# EAGLE design netzteil (EAGLE 6.5.0)
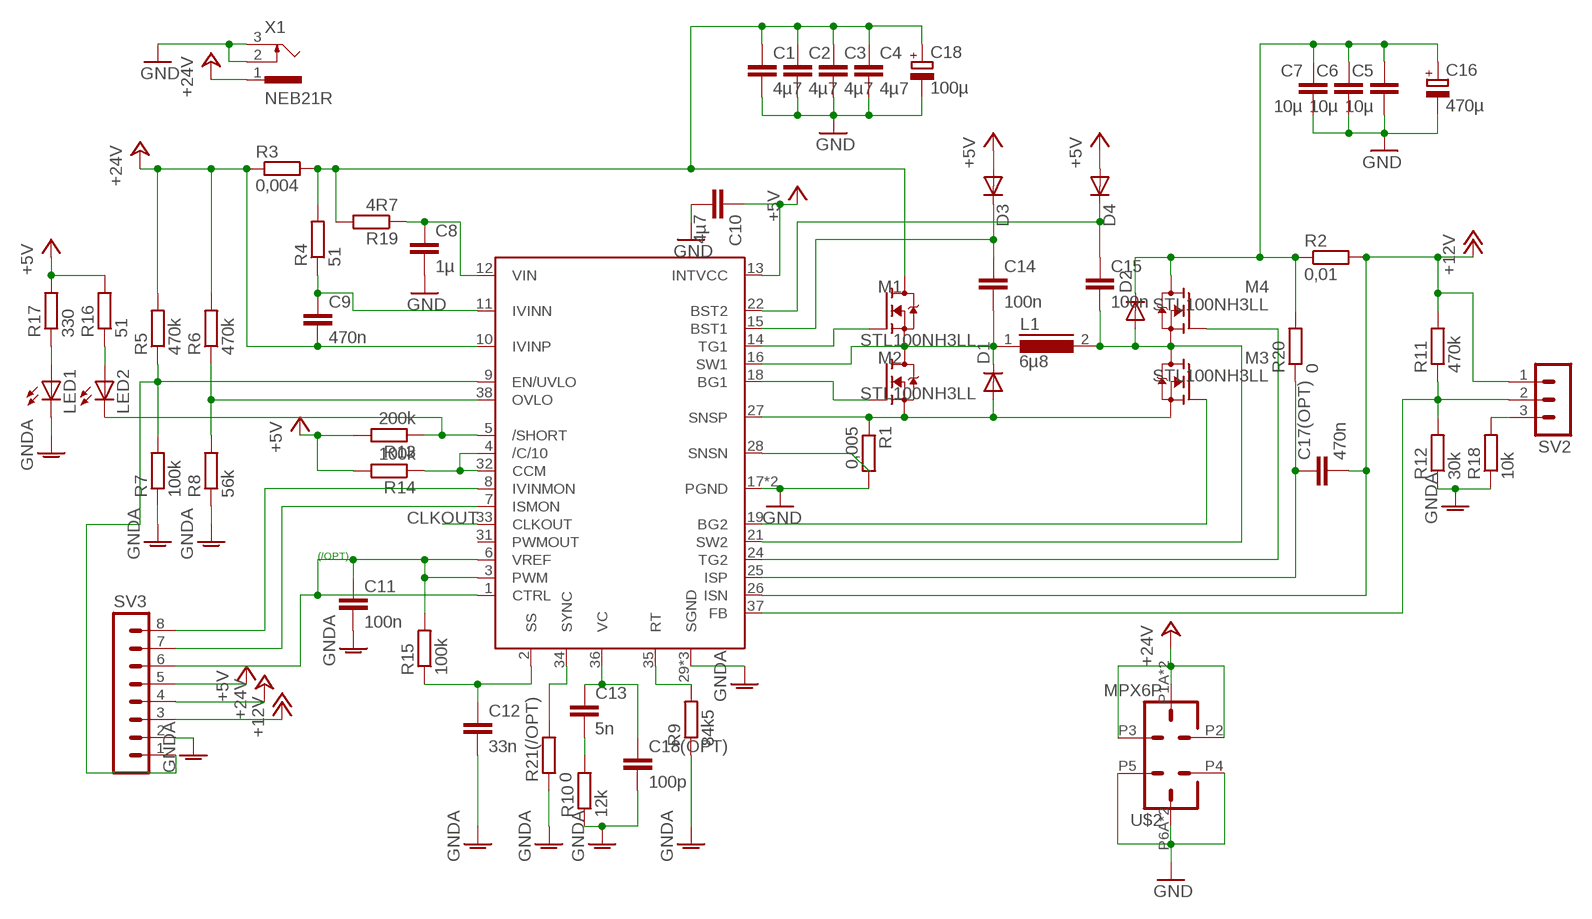
[diagram p0: schematic, sheet 1]

## Parts
C1  4µ7  C-EUC1206K  [C1206K]
C2  4µ7  C-EUC1206K  [C1206K]
C3  4µ7  C-EUC1206K  [C1206K]
C4  4µ7  C-EUC1206K  [C1206K]
C5  10µ  C-EUC1206K  [C1206K]
C6  10µ  C-EUC1206K  [C1206K]
C7  10µ  C-EUC1206K  [C1206K]
C8  1µ  C-EUC0805K  [C0805K]
C9  470n  C-EUC0805K  [C0805K]
C10  4µ7  C-EUC0805K  [C0805K]
C11  100n  C-EUC0805K  [C0805K]
C12  33n  C-EUC0805K  [C0805K]
C13  5n  C-EUC0805K  [C0805K]
C14  100n  C-EUC0805K  [C0805K]
C15  100n  C-EUC0805K  [C0805K]
C16  470µ  CPOL-EU153CLV-1010  [153CLV-1010]
C17(OPT)  470n  C-EUC0805K  [C0805K]
C18  100µ  CPOL-EU153CLV-0605  [153CLV-0605]
C18(OPT)  100p  C-EUC0805K  [C0805K]
D1  DIODE-SOD323-R  [SOD323-R]
D2  DIODE-SOD323-R  [SOD323-R]
D3  DIODE-SOD323-R  [SOD323-R]
D4  DIODE-SOD323-R  [SOD323-R]
L1  6µ8  DR125  [DR125]
LED1  LEDSML0805  [SML0805]
LED2  LEDSML0805  [SML0805]
M1  STL100NH3LL  [PG-TDSON-8]
M2  STL100NH3LL  [PG-TDSON-8]
M3  STL100NH3LL  [PG-TDSON-8]
M4  STL100NH3LL  [PG-TDSON-8]
R1  0,005  R-EU_R2512  [R2512]
R2  0,01  R-EU_R2512  [R2512]
R3  0,004  R-EU_R2512  [R2512]
R4  51  R-EU_M0805  [M0805]
R5  470k  R-EU_M0805  [M0805]
R6  470k  R-EU_M0805  [M0805]
R7  100k  R-EU_M0805  [M0805]
R8  56k  R-EU_M0805  [M0805]
R9  84k5  R-EU_M0805  [M0805]
R10  12k  R-EU_M0805  [M0805]
R11  470k  R-EU_M0805  [M0805]
R12  30k  R-EU_M0805  [M0805]
R13  200k  R-EU_M0805  [M0805]
R14  100k  R-EU_M0805  [M0805]
R15  100k  R-EU_M0805  [M0805]
R16  51  R-EU_M0805  [M0805]
R17  330  R-EU_M0805  [M0805]
R18  10k  R-EU_M0805  [M0805]
R19  4R7  R-EU_M0805  [M0805]
R20  0  R-EU_M0805  [M0805]
R21(/OPT)  0  R-EU_M0805  [M0805]
SV2  MA03-1  [MA03-1]
SV3  MA08-1  [MA08-1]
U$1  LT3790  [HTSSOP38DCP]
U$2  MPX6P  [MPX6]
X1  NEB21R  [NEB21R]

## Nets
+5V: C10.1 D3.A D4.A R13.2 R14.2 R16.2 R17.2 SV3.5 U$1.13(INTVCC)
+12V: C17(OPT).2 R2.2 R11.2 SV2.1 SV3.3 U$1.26(ISN)
+24V: C9.2 R3.1 R5.2 R6.2 SV3.4 U$1.10(IVINP) U$2.P1A U$2.P1B U$2.P2 U$2.P3 X1.1
BG1: M2.4(G) U$1.18(BG1)
BG2: M3.4(G) U$1.19(BG2)
BST1: C14.1 D3.C U$1.15(BST1)
BST2: C15.1 D4.C U$1.22(BST2)
CLKOUT: U$1.33(CLKOUT)
GND: C1.2 C2.2 C3.2 C4.2 C5.2 C6.2 C7.2 C8.2 C10.2 C16.- C18.- R1.2 U$1.17(PGND) U$1.20(PGND) U$2.P4 U$2.P5 U$2.P6A U$2.P6B X1.2 X1.3
GNDA: C11.2 C12.2 C18(OPT).2 LED1.C R7.1 R8.1 R9.1 R10.1 R12.1 R18.1 R21(/OPT).1 SV3.2 U$1.29(SGND) U$1.30(SGND) U$1.EXP@1(SGND)
ISP: C5.1 C6.1 C7.1 C16.+ D2.C M4.5(D) M4.6(D) M4.7(D) M4.8(D) M4.TH(D) R2.1 R20.2
N$1: U$1.28(SNSN)
N$2: SV3.7 U$1.7(ISMON)
N$3: SV3.8 U$1.8(IVINMON)
N$4: LED1.A R17.1
N$5: LED2.A R16.1
N$6: R18.2 SV2.3
N$7: C13.2 R10.2
N$8: C13.1 C18(OPT).1 U$1.36(VC)
N$9: C8.1 R19.1 U$1.12(VIN)
N$10: C17(OPT).1 R20.1 U$1.25(ISP)
N$12: C9.1 R4.1 U$1.11(IVINN)
N$13: R5.1 R7.2 SV3.1 U$1.9(EN/UVLO)
N$14: R6.1 R8.2 U$1.38(OVLO)
N$17: R11.1 R12.2 SV2.2 U$1.37(FB)
N$18: R14.1 U$1.4(/C/10) U$1.32(CCM)
N$20: LED2.C R13.1 U$1.5(/SHORT)
N$22: C12.1 R15.1 U$1.2(SS)
N$24: R9.2 U$1.35(RT)
N$25: C11.1 R15.2 SV3.6 U$1.1(CTRL) U$1.3(PWM) U$1.6(VREF)
SNSP: D1.A M2.1(S) M2.2(S) M2.3(S) M3.1(S) M3.2(S) M3.3(S) R1.1 U$1.27(SNSP)
SW1: C14.2 D1.C L1.1 M1.1(S) M1.2(S) M1.3(S) M2.5(D) M2.6(D) M2.7(D) M2.8(D) M2.TH(D) U$1.16(SW1)
SW2: C15.2 D2.A L1.2 M3.5(D) M3.6(D) M3.7(D) M3.8(D) M3.TH(D) M4.1(S) M4.2(S) M4.3(S) U$1.21(SW2)
SYNC: R21(/OPT).2 U$1.34(SYNC)
TG1: M1.4(G) U$1.14(TG1)
TG2: M4.4(G) U$1.24(TG2)
VINN: C1.1 C2.1 C3.1 C4.1 C18.+ M1.5(D) M1.6(D) M1.7(D) M1.8(D) M1.TH(D) R3.2 R4.2 R19.2
Unconnected: U$1.31(PWMOUT)

## Notes on the sheet
- (/OPT)

## Library data of the parts
C1-C15 C17(OPT) C18(OPT) = resistor:C-EU: CAPACITOR, European symbol
C16 C18 = resistor:CPOL-EU: POLARIZED CAPACITOR, European symbol
D1-D4 = diode:DIODE-: DIODE
L1 = inductors:DR125: High Power Density, High Efficiency, Shielded Inductors Source: coiltronics_dr_series.pdf
LED1 LED2 = led:LED: LED OSRAM: - CHIPLED LG R971, LG N971, LY N971, LG Q971, LY Q971, LO R971, LY R971 LH N974, LH R974 LS Q976, LO Q976, LY Q976 LO Q996 - Hyper CHIPLED LW Q18S LB Q993, LB Q99A, LB R99A - SideLED LS A670, LO A670, LY A670, LG A670, LP A670 LB A673, LV A673, LT A673, LW A673 LH A674 LY A675 LS A676, LA A676, LO A676, LY A676, LW A676 LS A679, LY A679, LG A679 - Hyper Micro SIDELED® LS Y876, LA Y876, LO Y876, LY Y876 LT Y87S - SmartLED LW L88C, LW L88S LB L89C, LB L89S, LG L890 LS L89K, LO L89K, LY L89K LS L896, LA L896, LO L896, LY L896 - TOPLED LS T670, LO T670, LY T670, LG T670, LP T670 LSG T670, LSP T670, LSY T670, LOP T670, LYG T670 LG T671, LOG T671, LSG T671 LB T673, LV T673, LT T673, LW T673 LH T674 LS T676, LA T676, LO T676, LY T676, LB T676, LH T676, LSB T676, LW T676 LB T67C, LV T67C, LT T67C, LS T67K, LO T67K, LY T67K, LW E67C LS E67B, LA E67B, LO E67B, LY E67B, LB E67C, LV E67C, LT E67C LW T67C LS T679, LY T679, LG T679 LS T770, LO T770, LY T770, LG T770, LP T770 LB T773, LV T773, LT T773, LW T773 LH T774 LS E675, LA E675, LY E675, LS T675 LS T776, LA T776, LO T776, LY T776, LB T776 LHGB T686 LT T68C, LB T68C - Hyper Mini TOPLED® LB M676 - Mini TOPLED Santana® LG M470 LS M47K, LO M47K, LY M47K Source: http://www.osram.convergy.de LUXEON: - LUMILED® LXK2-PW12-R00, LXK2-PW12-S00, LXK2-PW14-U00, LXK2-PW14-V00 LXK2-PM12-R00, LXK2-PM12-S00, LXK2-PM14-U00 LXK2-PE12-Q00, LXK2-PE12-R00, LXK2-PE12-S00, LXK2-PE14-T00, LXK2-PE14-U00 LXK2-PB12-K00, LXK2-PB12-L00, LXK2-PB12-M00, LXK2-PB14-N00, LXK2-PB14-P00, LXK2-PB14-Q00 LXK2-PR12-L00, LXK2-PR12-M00, LXK2-PR14-Q00, LXK2-PR14-R00 LXK2-PD12-Q00, LXK2-PD12-R00, LXK2-PD12-S00 LXK2-PH12-R00, LXK2-PH12-S00 LXK2-PL12-P00, LXK2-PL12-Q00, LXK2-PL12-R00 Source: www.luxeon.com KINGBRIGHT: KA-3528ASYC Source: www.kingbright.com
M1-M4 = teile:STL100NH3LL: STL100NH3LL n-fet 30V 12,5A(100A) 3,2mohm
R1-R20 R21(/OPT) = resistor:R-EU_: RESISTOR, European symbol
SV2 = con-lstb:MA03-1: PIN HEADER; OC_FARNELL: unknown; OC_NEWARK: unknown
SV3 = con-lstb:MA08-1: PIN HEADER; OC_FARNELL: unknown; OC_NEWARK: unknown
U$1 = teile:LT3790: Schaltregler synchron 4switch buck-boost 60V
U$2 = con-ml:MPX6P
X1 = con-lumberg:NEB21R: Netzgeräte-Einbaukupplung abgewinkelte Ausführung mit Öffner Source: http://www.lumberg.com/Produkte/PDFs/NEB21R.pdf; MPN: NEB 21 R; OC_FARNELL: 1217037; OC_NEWARK: 97K6458

## Board
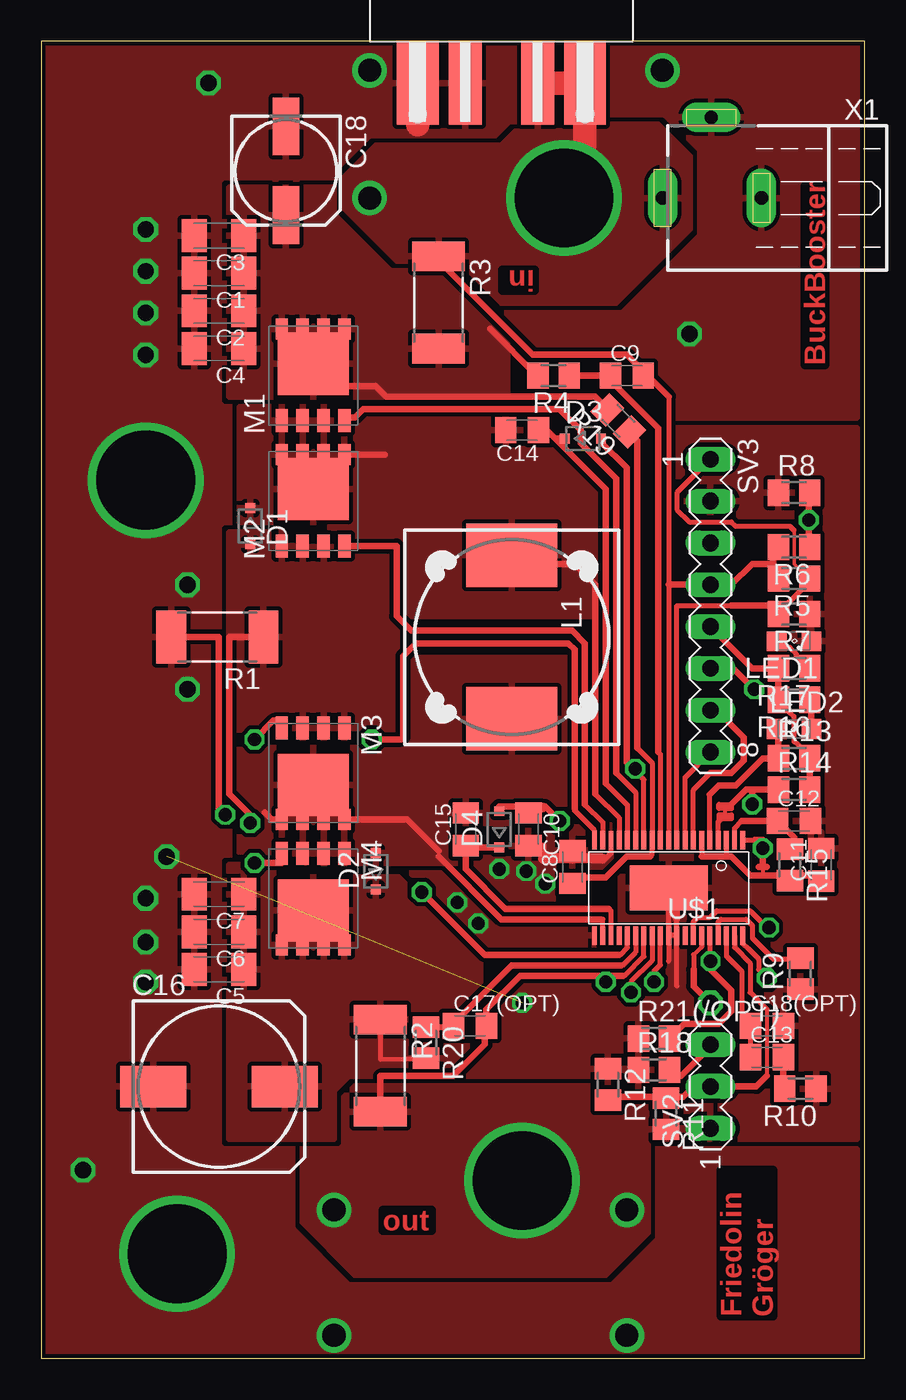
[diagram p1: board, top side]
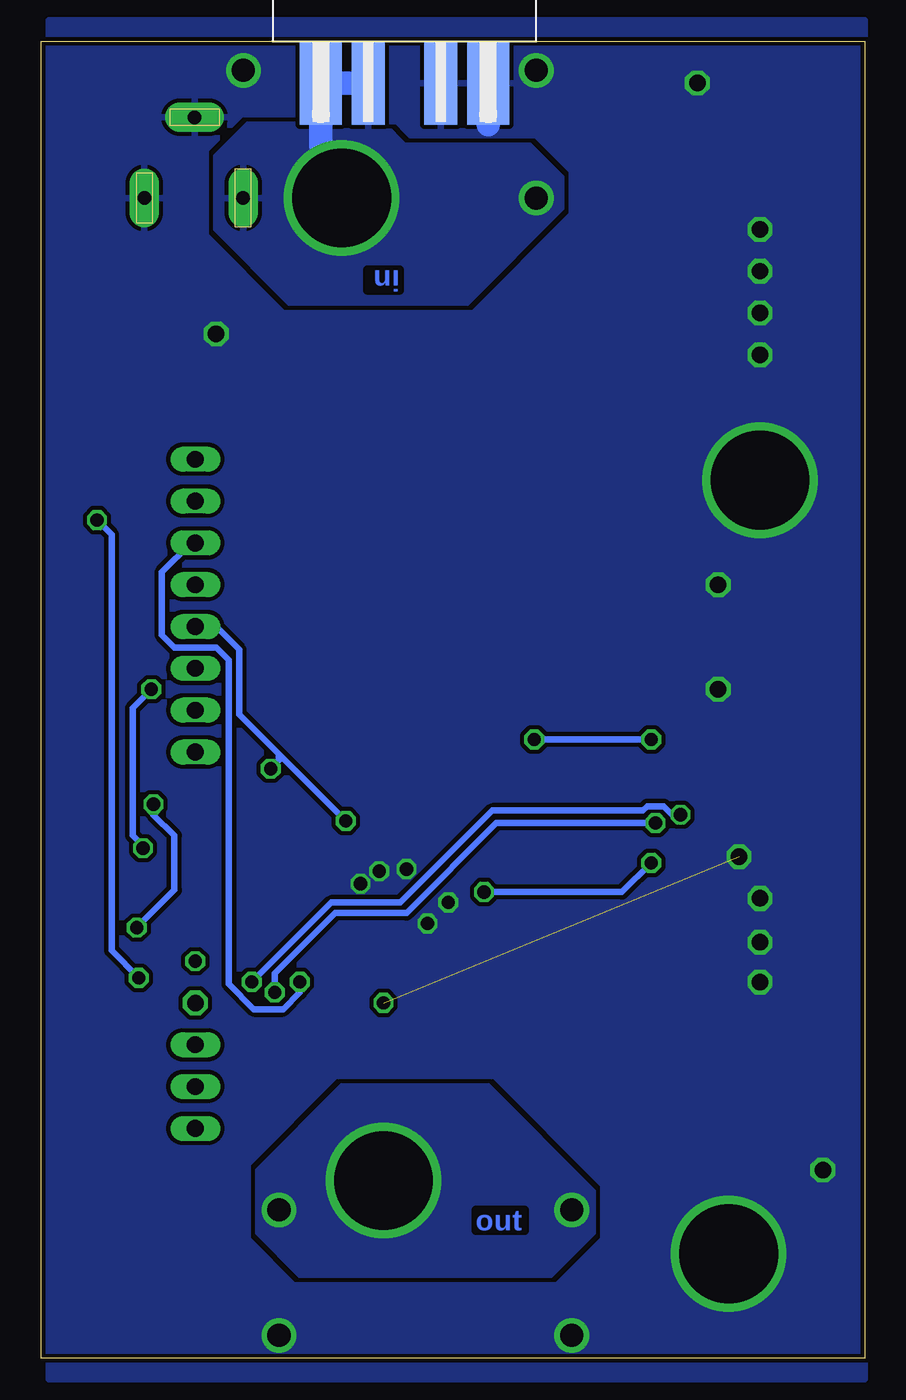
[diagram p2: board, bottom side, seen from below]

Size 50 x 80 mm. Coordinates in mm from the lower left corner, seen from the top.
Outline: 0,0 50,0 50,80 0,80 0,0
Copper layers (1*16): Top 0.035mm / dielectric 1.5mm / Bottom 0.035mm
Design rules "platinenbelichter2 *": minimum track width 0.18mm, minimum drill 23mil, track to track 0.2mm, track to pad 0.2mm, pad to pad 0.2mm, via to via 0.2mm, smd to smd 0.2mm, copper to edge 10mil, drill to drill 8mil, minimum pad ring 10mil, minimum via ring 8mil, stop-mask expansion 10mil, vias tented up to drill 0mil, thermal gap 10mil

### Footprints (pad centres in the part's own frame; a part is rotated, then mirrored left to right if it is on the bottom)
C1206K = smd 1.5 x 2: 1 -1.5,0; 2 1.5,0
C0805K = smd 1.3 x 1.6: 1 -1,0; 2 1,0
153CLV-1010 = smd 4 x 2.5: + 4,0; - -4,0
153CLV-0605 = smd 3.5 x 1.6: + 2.7,0; - -2.7,0
SOD323-R = smd 0.6 x 0.6: A 1.1,0; C -1.1,0
DR125 = smd 3.85 x 5.5: 1 -4.975,0; 2 4.975,0
SML0805 = smd 1.2 x 1.2: A 1.05,0; C -1.05,0
PG-TDSON-8 = smd 1.4 x 0.75: 1 -2.725,1.905; 2 -2.725,0.635; 3 -2.725,-0.635; 4 -2.725,-1.905 | smd 1.3 x 0.75: 5 2.825,-1.905; 6 2.825,-0.635; 7 2.825,0.635; 8 2.825,1.905 | smd 3.78 x 4.305: TH 0.725,0
R2512 = smd 1.8 x 3.2: 1 -2.8,0; 2 2.8,0
M0805 = smd 1.3 x 1.6: 1 -0.95,0; 2 0.95,0
MA03-1 = drill 1.016 long: 1 -2.54,0; 2 0,0; 3 2.54,0
MA08-1 = drill 1.016 long: 1 -8.89,0; 2 -6.35,0; 3 -3.81,0; 4 -1.27,0; 5 1.27,0; 6 3.81,0; 7 6.35,0; 8 8.89,0
HTSSOP38DCP = smd 0.3 x 1.1: 1 -4.5,-2.9; 2 -4,-2.9; 3 -3.5,-2.9; 4 -3,-2.9; 5 -2.5,-2.9; 6 -2,-2.9; 7 -1.5,-2.9; 8 -1,-2.9; 9 -0.5,-2.9; 10 0,-2.9; 11 0.5,-2.9; 12 1,-2.9; 13 1.5,-2.9; 14 2,-2.9; 15 2.5,-2.9; 16 3,-2.9; 17 3.5,-2.9; 18 4,-2.9; 19 4.5,-2.9; 20 4.5,2.9; 21 4,2.9; 22 3.5,2.9; 23 3,2.9; 24 2.5,2.9; 25 2,2.9; 26 1.5,2.9; 27 1,2.9; 28 0.5,2.9; 29 0,2.9; 30 -0.5,2.9; 31 -1,2.9; 32 -1.5,2.9; 33 -2,2.9; 34 -2.5,2.9; 35 -3,2.9; 36 -3.5,2.9; 37 -4,2.9; 38 -4.5,2.9 | smd 4.75 x 2.743: EXP@1 0,0
MPX6 = smd 2.54 x 5.08 bottom: P1A 5.08,-2.54; P6A -5.08,-2.54 | smd 2.54 x 5.08: P1B 5.08,-2.54; P6B -5.08,-2.54 | smd 2 x 5.08: P2 2.2,-2.54; P4 -2.2,-2.54 | smd 2 x 5.08 bottom: P3 2.2,-2.54; P5 -2.2,-2.54 | hole 1: -5.08,-4.445; 5.08,-4.445
NEB21R = drill 0.813 pad 1.778 long: 1 0,7.35; 2 4.9,4.4; 3 0,1.35

### Placement (x,y rotation side)
C1  10.79,65.91 180 top
C2  10.79,63.63 180 top
C3  10.79,68.2 180 top
C4  10.79,61.34 180 top
C5  10.79,23.62 180 top
C6  10.79,25.91 180 top
C7  10.79,28.19 180 top
C8  32.26,29.84 90 top
C9  35.56,59.69 0 top
C10  29.59,32.13 270 top
C11  47.37,29.97 90 top
C12  45.72,32.64 0 top
C13  44.07,18.29 0 top
C14  29.21,56.39 180 top
C15  25.78,32.13 90 top
C16  10.79,16.51 0 top
C17(OPT)  26.04,20.19 0 top
C18  14.86,72.14 270 top
C18(OPT)  44.07,20.19 0 top
D1  12.7,50.55 270 top
D2  20.32,29.59 90 top
D3  32.89,55.88 0 top
D4  27.81,32.13 90 top
L1  28.57,43.81 270 top
LED1  45.72,43.56 180 top
LED2  45.72,38.23 0 top
M1  16.51,59.69 90 top
M2  16.51,52.07 90 top
M3  16.51,35.56 270 top
M4  16.51,27.94 270 top
R1  10.7,43.81 180 top
R2  20.59,17.78 270 top
R3  24.13,64.14 270 top
R4  31.11,59.69 180 top
R5  45.72,47.37 180 top
R6  45.72,49.28 180 top
R7  45.72,45.21 180 top
R8  45.72,52.58 0 top
R9  46.1,23.37 90 top
R10  46.1,16.38 180 top
R11  37.94,14.86 270 top
R12  34.42,16.64 270 top
R13  45.72,36.45 0 top
R14  45.72,34.54 0 top
R15  45.47,29.97 270 top
R16  45.72,40.01 180 top
R17  45.72,41.91 180 top
R18  37.21,17.53 0 top
R19  35.05,56.95 135 top
R20  23.37,19.18 270 top
R21(/OPT)  37.21,19.43 0 top
SV2  40.64,16.51 90 top
SV3  40.64,45.72 270 top
U$1  38.1,28.57 180 top
U$2  27.94,80.01 0 top
X1  45.09,70.48 90 top

### Tracks (layer width: path | path; a pad name or v marks a point on that pad's centre or on a via)
+5V  (via drill 0.8)
  Top 0.3: U$1.13 36.6,35.16 36.07,35.69 | R13.2 46.67,36.64 45.72,37.47 45.72,38.99 45.21,39.37 45.21,39.56 R16.2
  Top 0.406: C10.1 30.48,33.38 30.48,33.53 | 30.48,33.53 30.48,33.55 | R14.2 R13.2 46.99,36.52 | v36.07,35.81 36.07,35.69 35.56,36.2 35.56,54.1 33.99,55.67 D3.A | R16.2 R17.2 43.18,41.91 SV3.5 | D4.A 27.81,33.53 30.48,33.53 | 30.48,33.53 30.61,33.53 v31.5,32.64
  Bottom 0.406: v31.5,32.64 35.56,36.7 | 35.56,36.7 35.56,36.32 v36.07,35.81 | 35.56,36.7 37.97,39.12 37.97,43.05 39.37,44.45 SV3.5
+12V  (via drill 0.8, 1.4, 6)
  Top 0.3: 35.33,23.24 35.43,23.24 36.6,24.41 U$1.26
  Top 0.406: R2.2 20.59,17.14 25.02,17.14 26.94,19.06 26.94,20.09 C17(OPT).2 27.04,21.19 29.08,23.24 34.42,23.24 | 35.33,23.24 34.42,23.24 | v34.29,22.86 34.29,23.11 34.42,23.24
  Bottom 0.406: SV3.3 40.89,49.53 42.67,47.75 42.67,43.94 41.91,43.18 39.37,43.18 38.61,42.42 38.61,22.73 37.08,21.21 35.31,21.21 34.29,22.23 v34.29,22.86
  other vias: 29.21,10.79 17.78,9.02 35.56,9.02
  pour Top (isolate 0.254, rank 2): 15.88,16.51 40.64,16.51 40.64,13.34 36.83,13.34 36.83,7.62 34.29,5.08 19.05,5.08 15.88,8.26
  pour Bottom (isolate 0.254): 16.51,7.62 16.51,10.16 22.86,16.51 31.75,16.51 36.83,11.43 36.83,7.62 34.29,5.08 19.05,5.08
+24V  (via drill 1.4, 6)
  Top 0.3: 38.1,46.99 U$1.10
  Top 0.305: 38.1,58.42 38.1,46.99
  Top 0.406: 38.1,46.99 SV3.4 41.91,46.99 43.18,48.26 44.45,48.26 | 38.1,58.42 36.94,59.58 C9.2 36.56,59.96 35.56,60.96 29.84,60.96 24.13,66.67 R3.1 | 44.45,48.26 44.77,47.94 R5.2 | R6.2 44.45,48.96 44.45,48.26
  Top 1.422: 30.48,77.47 U$2.P1B 33.02,73.66
  Bottom 1.422: U$2.P3 U$2.P1B 33.02,73.66
  other vias: 31.75,70.48 19.94,70.48
  pour Top (isolate 0.254): 18.41,71.75 20.32,73.66 27.94,73.66 29.21,74.93 37.47,74.93 39.37,73.03 39.37,68.58 34.92,64.14 27.94,64.14 25.4,66.67 21.59,66.67 18.41,69.85
  pour Bottom (isolate 0.254): 18.41,71.75 18.41,69.85 24.13,64.14 34.92,64.14 39.37,68.58 39.37,73.03 37.47,74.93 29.21,74.93 27.94,73.66 20.32,73.66
BG1
  Top 0.3: 33.02,33.66 34.1,32.58 U$1.18
  Top 0.406: M2.4 21.59,49.34 21.59,45.09 22.48,44.2 32.26,44.2 33.02,43.43 33.02,33.66
BG2  (via drill 0.8)
  Top 0.3: U$1.19 33.6,32.06 33.15,32.51
  Top 0.305: 32.38,33.4 32.38,33.27 33.15,32.51
  Top 0.406: M3.4 14.61,38.73 14.1,38.73 v12.95,37.59 | 32.38,33.4 32.38,43.05 32,43.43 22.73,43.43 21.97,42.67 21.97,37.72 21.84,37.59 v20.07,37.59
  Bottom 0.406: v12.95,37.59 v20.07,37.59
BST1
  Top 0.3: 34.29,34.92 35.6,33.62 U$1.15
  Top 0.406: 34.29,34.92 34.29,52.8 31.21,55.88 | D3.C 31.21,55.88 | 31.21,55.88 30.7,56.39 C14.1
BST2
  Top 0.3: 34.47,27.3 34.6,27.18 U$1.22
  Top 0.406: 34.47,27.3 28.19,27.3 25.78,29.72 C15.1 25.91,31.03 D4.C
CLKOUT  (via drill 1)
  Top 0.254: 40.1,24.99 39.62,24.51
  Top 0.3: U$1.33 40.1,24.99 | 39.62,24.51 39.62,23.62
  Top 0.406: 39.62,23.62 39.62,22.61 v40.64,21.59
GND  (via drill 0.8, 1, 1.4, 6)
  Top 0.3: U$1.17 34.6,30.66 34.29,30.35 34.09,30.35
  Top 0.406: 30.48,30.35 30.48,31.13 C10.2 | C8.2 32.26,30.35
  Top 0.61: 34.09,30.35 32.26,30.35 30.48,30.35
  Top 1.422: 22.86,74.93 U$2.P6A
  Bottom 1.422: 22.86,74.93 U$2.P6A
  other vias: 25.27,27.69 26.54,26.42 27.81,29.72 29.46,29.59 30.61,28.83 8.89,40.64 6.35,27.94 6.35,25.27 6.35,22.86 8.89,46.99 6.35,60.96 6.35,66.04 6.35,68.58 35.56,1.4 17.78,1.4 2.54,11.43 39.37,62.23 10.16,77.47 7.62,30.48 6.35,63.5 8.26,6.35 6.35,53.34 37.72,78.23 19.94,78.23
  pour Top (isolate 0.254, rank 5): -1.27,82.55 -1.27,-2.54 49.53,-2.54 49.53,12.7 35.56,12.7 35.56,57.15 49.53,57.15 49.53,82.55
  pour Bottom (isolate 0.254, rank 2): 0,-1.27 0,81.28 49.53,81.28 49.53,-1.27
GNDA  (via drill 0.8)  (1 unrouted)
  Top 0.3: U$1.29 38.1,27.94 | U$1.30 38.6,26.67 | U$1.30 U$1.29 | U$1.29 38.1,24.13 | 38.6,22.61 U$1.30
  Top 0.406: 38.1,27.94 U$1.EXP@1 | 38.1,27.94 38.6,27.44 38.6,26.67 38.1,27.94
  Bottom 0.406: 7.62,30.48 7.49,30.48
  other vias: 29.21,21.59
  pour Top (isolate 0.254, rank 4): 25.4,13.34 25.4,24.13 35.18,24.13 35.18,56.52 49.53,56.52 49.53,13.34
ISP
  Top 0.3: R2.1 20.6,18.17 R20.2
  pour Top (isolate 0.254): 24.77,17.14 26.67,19.05 26.67,24.13 21.72,29.21 14.99,29.21 14.35,29.97 11.43,29.97 11.43,13.34 17.78,13.34 17.78,16.26 18.67,17.14
N$1  (via drill 0.8)
  Top 0.3: U$1.28 37.6,23.88 37.21,23.5 v37.21,22.86
  Top 0.406: v11.18,33.02 10.79,33.4 10.79,43.81 8.89,43.81
  Bottom 0.406: v11.18,33.02 11.68,33.02 12.19,33.53 13.21,33.53 13.46,33.27 22.61,33.27 28.19,27.69 32.38,27.69 v37.21,22.86
N$2
  Top 0.3: U$1.7 39.6,34.52 40.64,35.56
  Top 0.406: 40.64,35.56 41.91,35.56 42.67,36.32 42.67,37.72 41.02,39.37 SV3.7
N$3
  Top 0.3: U$1.8 39.1,35.29 SV3.8
N$4
  Top 0.3: 46.67,41.98 R17.1 46.61,41.91 45.85,42.67 45.85,42.8 45.47,43.18 45.05,43.18 LED1.A
N$5
  Top 0.406: LED2.A 46.77,39.91 R16.1
N$6
  Top 0.406: R18.2 37.78,17.59 37.97,17.14 38.86,17.14 40.64,18.92 SV2.3
N$7
  Top 0.406: C13.2 45.07,16.46 R10.2
N$8
  Top 0.3: U$1.36 41.6,24.44 42.55,23.5
  Top 0.305: 42.55,23.5 42.55,20.72 C18(OPT).1 C13.1
N$9
  Top 0.3: 36.2,37.08 37.1,36.18 U$1.12 37.1,30.61 36.97,30.48
  Top 0.406: 36.2,37.08 36.2,55.75 35.72,56.22 R19.1 | 36.97,30.48 35.56,30.48 34.29,29.21 32.38,29.21 C8.1
N$10
  Top 0.3: 35.21,23.88 35.31,23.88 36.1,24.67 U$1.25 | R20.1 24.82,20.09 C17(OPT).1
  Top 0.406: R20.1 24.81,20.11 28.57,23.88 35.21,23.88
N$12
  Top 0.3: 37.47,36.83 37.6,36.7 U$1.11
  Top 0.406: 37.47,36.83 37.47,56.52 34.29,59.69 | R4.1 32.06,60.01 32.38,59.69 34.29,59.69 | C9.1 34.29,59.69
N$13
  Top 0.2: 45.72,50.29 45.72,48.26 46.61,47.37
  Top 0.3: U$1.9 38.6,45.72 41.91,45.72
  Top 0.305: SV3.1 38.61,52.58 38.61,51.56 39.37,50.8 41.91,50.8 42.16,50.55 45.47,50.55 45.72,50.29 | 44.83,45.21 R7.2 44.77,45.28 46.67,47.18 R5.1 | 46.67,47.3 R5.1 | 46.61,47.37 R5.1
  Top 0.406: R7.2 44.26,45.72 41.91,45.72
N$14  (via drill 0.8)
  Top 0.3: U$1.38 42.6,25.22 42.93,24.89
  Top 0.305: 42.93,24.89 43.56,24.26 43.56,23.62 v44.07,23.11
  Top 0.406: R6.1 46.61,49.34 v46.61,50.93 46.61,52.52 R8.2
  Bottom 0.406: v44.07,23.11 45.72,24.77 45.72,50.04 v46.61,50.93
N$17
  Top 0.254: 44.07,21.21 44.07,17.14
  Top 0.3: U$1.37 42.1,24.96 43.05,24
  Top 0.305: 43.05,24 43.05,22.23 44.07,21.21
  Top 0.406: 44.07,17.14 43.43,16.51 SV2.2 39.62,16.51 38.99,15.88 37.85,15.88 | 37.85,15.88 34.6,15.88 R12.2 | R11.1 37.91,15.81 37.85,15.88
N$18  (via drill 0.8)
  Top 0.254: 41.53,33.02 41.53,33.4
  Top 0.3: U$1.4 41.1,32.59 41.53,33.02 | U$1.32 39.6,26.52
  Top 0.305: 39.6,26.52 39.88,26.8 40.64,26.8 41.02,27.18 43.05,27.18 44.07,26.16 v44.2,26.16 | 41.27,32.77 41.91,32.77 41.91,33.02 41.53,33.02 41.15,33.02 41.15,32.77 | 41.53,33.4 41.15,33.4 41.15,33.66 41.91,33.66 41.91,33.4 41.53,33.4
  Top 0.406: 43.18,34.54 42.8,34.54 41.91,33.66 | 43.18,34.54 R14.1 | v43.18,33.66 43.18,34.54
  Bottom 0.406: v44.2,26.16 41.91,28.45 41.91,31.75 43.18,33.02 v43.18,33.66
N$20
  Top 0.3: U$1.5 40.6,34.25
  Top 0.406: 40.6,34.25 41.15,34.8 42.16,34.8 43.81,36.45 R13.1 44.77,38.13 LED2.C
N$22
  Top 0.3: U$1.2 42.1,32.19 42.55,32.64
  Top 0.406: 42.55,32.64 C12.1 45.72,31.64 45.72,30.48 45.4,30.8 R15.1
N$24
  Top 0.3: U$1.35 41.1,26.5 | 42.8,26.67 43.18,26.29
  Top 0.305: 41.1,26.5 41.27,26.67 42.8,26.67 | 43.18,26.29 43.18,25.53 44.45,24.26 45.78,24.26 R9.2
N$25  (via drill 0.8)
  Top 0.254: 43.81,29.84 43.81,29.34
  Top 0.3: U$1.1 43.33,31.48 | U$1.6 40.1,30.48 | U$1.3 41.6,30.48
  Top 0.406: v43.31,40.64 42.04,41.91 SV3.6 | 43.33,31.48 43.81,31.48 v43.81,30.99 43.81,29.84 | 40.1,30.48 41.6,30.48 41.91,30.48 43.05,29.34 43.81,29.34 45.72,29.34 | 44.07,29.84 43.81,29.84 | 43.56,29.84 43.81,29.84 | 45.72,29.34 47.01,29.34 C11.1 | R15.2 45.47,29.08 45.72,29.34
  Bottom 0.406: v43.81,30.99 43.81,31.11 44.45,31.75 44.45,39.5 v43.31,40.64
SNSP  (via drill 0.8)
  Top 0.3: U$1.27 37.1,24.15 35.81,22.86 v35.81,22.23
  Top 0.406: v12.7,32.51 12.7,33.02 11.43,34.29 11.43,43.81 R1.1
  Bottom 0.406: v12.7,32.51 22.35,32.51 27.81,27.05 32.13,27.05 35.81,23.37 v35.81,22.23
  pour Top (isolate 0.254, rank 2): 21.59,49.28 21.59,37.72 12.06,37.72 12.06,43.81 11.43,43.81 11.43,50.16 15.24,50.16 15.24,49.28
SW1
  Top 0.3: 33.66,34.29 35.1,32.84 U$1.16
  Top 0.406: 33.66,34.29 33.66,46.99 32.38,48.26 30.48,48.26 29.84,48.9 | 29.84,48.9 29.21,49.53 29.21,49.42 L1.1 | 30.88,48.26 29.21,48.26 29.84,48.9 | M2.5 20.88,54.9
  pour Top (isolate 0.254, rank 3): 34.29,45.09 34.29,57.78 12.06,57.78 12.06,50.8 17.14,50.8 18.41,49.53 22.23,49.53 22.23,45.09
SW2
  Top 0.3: U$1.21 34.1,26.67 33.97,26.67
  Top 0.406: M3.8 22.23,32.73 24.13,30.83 | 33.97,26.67 27.94,26.67 24.13,30.48 | M3.5 14,32.73 13.59,33.15
  pour Top (isolate 0.254): 33.02,32.51 33.02,42.55 22.23,42.55 22.23,37.08 12.06,37.08 12.06,30.73 15.24,30.73 16.13,30.1 25.27,30.1 25.27,32.51
SYNC  (via drill 0.8)
  Top 0.3: U$1.34 40.6,24.17 v40.64,24.13
  Top 0.406: v40.64,24.13 40.64,23.62 41.91,22.35 41.91,21.08 41.15,20.32 39.05,20.32 R21(/OPT).2
TG1
  Top 0.3: 34.92,35.56 36.1,34.38 U$1.14
  Top 0.406: M1.4 18.6,57.15 19.05,57.15 19.56,57.66 31.5,57.66 31.5,57.64 32.75,56.39 32.75,55.61 34.92,53.44 34.92,35.56
TG2  (via drill 0.8)
  Top 0.3: 35.09,24.51 35.18,24.51 35.6,24.93 U$1.24
  Top 0.406: v23.11,28.32 26.92,24.51 35.09,24.51 | M4.4 14.61,30.1 v12.95,30.1
  Bottom 0.406: v12.95,30.1 14.73,28.32 v23.11,28.32
VINN
  Top 0.406: M1.TH 17.78,59.05 20.32,59.05 20.95,58.42 33.66,58.42 34.38,57.7 R19.2 | R3.2 24.13,60.96 24.77,60.96 | R4.2 30.1,59.69 27.25,62.53
  pour Top (isolate 0.254, rank 4): 28.3,58.42 28.3,71.12 11.43,71.12 11.43,58.42

### Text on the board
Top: in | BuckBooster | out | Friedolin / Gröger
Bottom: in | out